# Altium project Project2.PrjPCB
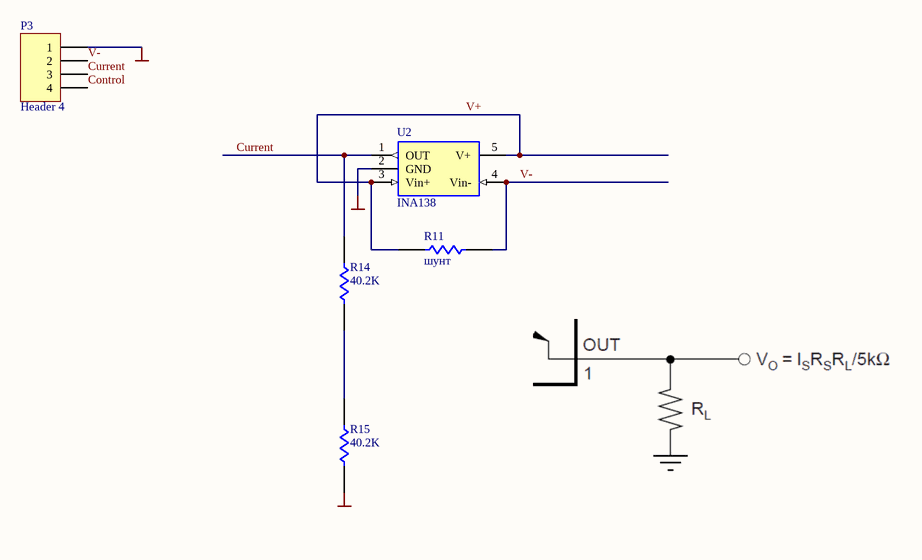
[diagram p0: Sheet2.SchDoc]
1 sheet, 5 parts. Net scope: global (net labels, ports and power ports of the same name join across sheets).

## Sheet Sheet2.SchDoc
size A4

### Parts
P3  Header 4  [HDR1X4]
R11  шунт  [6-0805_M]
R14  40.2K  [6-0805_M]
R15  40.2K  [6-0805_M]
U2  INA138  [SOT23-5_M]

### Nets
GND: P3.1 R15.2 U2.2(GND)
Control: P3.4
Current: P3.3 R14.1 U2.1(OUT)
V+: R11.1 U2.3(Vin+) U2.5(V+)
V-: P3.2 R11.2 U2.4(Vin-)
NetR14_2: R14.2 R15.1

### Library data of the parts
P3 = Header 4: Header, 4-Pin; LatestRevisionDate: 17-Jul-2002; LatestRevisionNote: Re-released for DXP Platform.; Publisher: Altium Limited
R11 R14 R15 = Resistor: Published: 24-Mar-1999; LatestRevisionDate: 29-May-2009; LatestRevisionNote: IPC-7351 Footprint Added.; PackageVersion: Mar-2003; PackageReference: 6-0805; Publisher: Altium Limited; PackageDescription: Chip Resistor 0805 Case Size; Code_IPC: RESC2012
U2 = INA138: INA 138 Current monitor; Published: 24-Mar-1999; LatestRevisionDate: 17-Jul-2002; LatestRevisionNote: Re-released for DXP Platform.; PackageReference: DIP-6; Publisher: Altium Limited; Code_JEDEC: MO-001-AM